# EAGLE design Power Outlet (EAGLE 6.4)
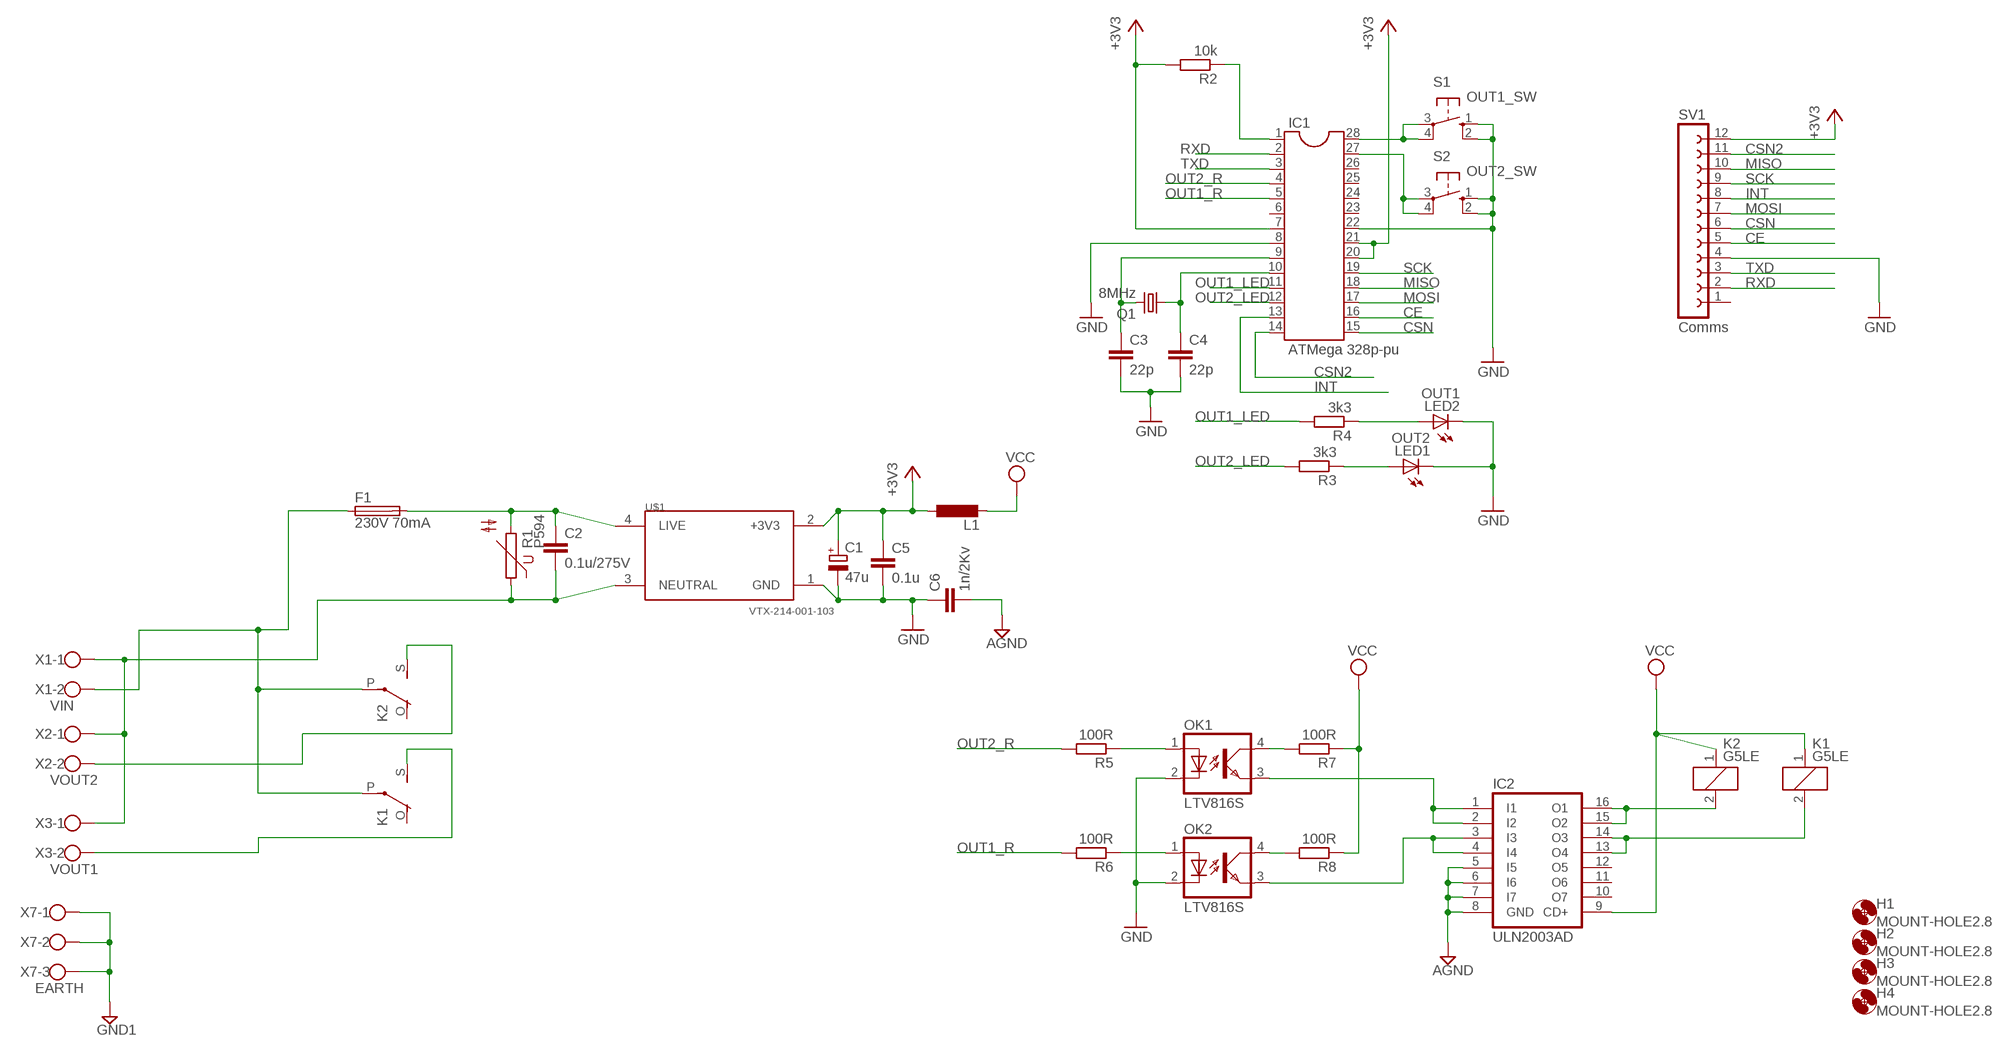
[diagram p0: schematic, sheet 1]

## Parts
C1  47u  CPOL-EUE2,5-6E  [E2,5-6E]
C2  0.1u/275V  C-EU050-030X075  [C050-030X075]
C3  22p  C-EUC1206K  [C1206K]
C4  22p  C-EUC1206K  [C1206K]
C5  0.1u  C-EUC1206K  [C1206K]
C6  1n/2Kv  C-EUC1206K  [C1206K]
F1  230V 70mA  FUSESH22,5A  [SH22,5A]
H1  MOUNT-HOLE2.8  [2,8]
H2  MOUNT-HOLE2.8  [2,8]
H3  MOUNT-HOLE2.8  [2,8]
H4  MOUNT-HOLE2.8  [2,8]
IC1  ATMega 328p-pu  DIL28-3  [DIL28-3]
IC2  ULN2003AD  [SO16]
K1  G5LE  [G5LE]
K2  G5LE  [G5LE]
L1  L-EUL3225P  [L3225P]
LED1  OUT2  LED5MM  [LED5MM]
LED2  OUT1  LED5MM  [LED5MM]
OK1  LTV816S  [SMD4]
OK2  LTV816S  [SMD4]
Q1  8MHz  CRYSTALHC49S  [HC49/S]
R1  P594  [P594]
R2  10k  R-EU_R1206W  [R1206W]
R3  3k3  R-EU_R1206W  [R1206W]
R4  3k3  R-EU_R1206W  [R1206W]
R5  100R  R-EU_R1206W  [R1206W]
R6  100R  R-EU_R1206W  [R1206W]
R7  100R  R-EU_R1206W  [R1206W]
R8  100R  R-EU_R1206W  [R1206W]
S1  OUT1_SW  40-XX  [B3F-40XX]
S2  OUT2_SW  40-XX  [B3F-40XX]
SV1  Comms  FE12W  [FE12W]
U$1  VTX-214-001-103  [VTX214001103]
X1  VIN  W237-102  [W237-102]
X2  VOUT2  W237-102  [W237-102]
X3  VOUT1  W237-102  [W237-102]
X7  EARTH  W237-103  [W237-103]

## Nets
+3V3: C1.+ C5.1 IC1.7 IC1.20 IC1.21 L1.1 R2.2 SV1.12 U$1.2(+3V3)
AGND: C6.2 IC2.5(I5) IC2.6(I6) IC2.7(I7) IC2.8(GND)
CE: IC1.16 SV1.5
CSN: IC1.15 SV1.6
CSN2: IC1.14 SV1.11
GND: C1.- C3.2 C4.2 C5.2 C6.1 IC1.8 IC1.22 LED1.K(C) LED2.K(C) OK1.2(C) OK2.2(C) S1.1(S) S1.2(S1) S2.1(S) S2.2(S1) SV1.4 U$1.1(GND)
GND1: X7.1 X7.2 X7.3
INT: IC1.13 SV1.8
MISO: IC1.18 SV1.10
MOSI: IC1.17 SV1.7
N$1: F1.1 K1.P(2:P) K2.P(2:P) X1.2
N$2: C2.1 F1.2 R1.2 U$1.4(LIVE)
N$3: C2.2 R1.1 U$1.3(NEUTRAL) X1.1 X2.1 X3.1
N$4: IC1.1 R2.1
N$5: C3.1 IC1.9 Q1.2
N$6: C4.1 IC1.10 Q1.1
N$7: LED1.A R3.1
N$8: LED2.A R4.1
N$9: IC1.28 S1.3(P) S1.4(P1)
N$10: IC1.27 S2.3(P) S2.4(P1)
N$11: K2.S(2:S) X2.2
N$12: IC2.15(O2) IC2.16(O1) K2.2
N$13: IC2.13(O4) IC2.14(O3) K1.2
N$14: K1.S(2:S) X3.2
N$15: OK1.1(A) R5.1
N$16: OK2.1(A) R6.1
N$17: IC2.1(I1) IC2.2(I2) OK1.3(EMIT)
N$18: IC2.3(I3) IC2.4(I4) OK2.3(EMIT)
N$19: OK1.4(COL) R7.2
N$20: OK2.4(COL) R8.2
OUT1_LED: IC1.11 R4.2
OUT1_R: IC1.5 R6.2
OUT2_LED: IC1.12 R3.2
OUT2_R: IC1.4 R5.2
RXD: IC1.2 SV1.2
SCK: IC1.19 SV1.9
TXD: IC1.3 SV1.3
VCC: IC2.9(CD+) K1.1 K2.1 L1.2 R7.1 R8.1
Unconnected: IC1.6 IC1.23 IC1.24 IC1.25 IC1.26 IC2.10(O7) IC2.11(O6) IC2.12(O5) K1.O(2:O) K2.O(2:O) SV1.1

## Library data of the parts
C1 = rcl:CPOL-EU: POLARIZED CAPACITOR, European symbol
C2-C6 = rcl:C-EU: CAPACITOR, European symbol
F1 = fuse:FUSE: Fuse; OC_FARNELL: unknown; OC_NEWARK: unknown
H1-H4 = holes:MOUNT-HOLE: MOUNTING HOLE with drill center marker
IC1 = ic-package:DIL28: Dual In Line
IC2 = uln-udn:ULN2003A: DRIVER ARRAY
K1 K2 = relay:G5LE: RELAY 1 x switch, 10 A/120 V AC, 8 A/30 V DC, Omron; OC_FARNELL: unknown; OC_NEWARK: unknown
L1 = rcl:L-EU: INDUCTOR, European symbol
LED1 LED2 = led:LED: LED OSRAM: - CHIPLED LG R971, LG N971, LY N971, LG Q971, LY Q971, LO R971, LY R971 LH N974, LH R974 LS Q976, LO Q976, LY Q976 LO Q996 - Hyper CHIPLED LW Q18S LB Q993, LB Q99A, LB R99A - SideLED LS A670, LO A670, LY A670, LG A670, LP A670 LB A673, LV A673, LT A673, LW A673 LH A674 LY A675 LS A676, LA A676, LO A676, LY A676, LW A676 LS A679, LY A679, LG A679 - Hyper Micro SIDELED® LS Y876, LA Y876, LO Y876, LY Y876 LT Y87S - SmartLED LW L88C, LW L88S LB L89C, LB L89S, LG L890 LS L89K, LO L89K, LY L89K LS L896, LA L896, LO L896, LY L896 - TOPLED LS T670, LO T670, LY T670, LG T670, LP T670 LSG T670, LSP T670, LSY T670, LOP T670, LYG T670 LG T671, LOG T671, LSG T671 LB T673, LV T673, LT T673, LW T673 LH T674 LS T676, LA T676, LO T676, LY T676, LB T676, LH T676, LSB T676, LW T676 LB T67C, LV T67C, LT T67C, LS T67K, LO T67K, LY T67K, LW E67C LS E67B, LA E67B, LO E67B, LY E67B, LB E67C, LV E67C, LT E67C LW T67C LS T679, LY T679, LG T679 LS T770, LO T770, LY T770, LG T770, LP T770 LB T773, LV T773, LT T773, LW T773 LH T774 LS E675, LA E675, LY E675, LS T675 LS T776, LA T776, LO T776, LY T776, LB T776 LHGB T686 LT T68C, LB T68C - Hyper Mini TOPLED® LB M676 - Mini TOPLED Santana® LG M470 LS M47K, LO M47K, LY M47K Source: http://www.osram.convergy.de LUXEON: - LUMILED® LXK2-PW12-R00, LXK2-PW12-S00, LXK2-PW14-U00, LXK2-PW14-V00 LXK2-PM12-R00, LXK2-PM12-S00, LXK2-PM14-U00 LXK2-PE12-Q00, LXK2-PE12-R00, LXK2-PE12-S00, LXK2-PE14-T00, LXK2-PE14-U00 LXK2-PB12-K00, LXK2-PB12-L00, LXK2-PB12-M00, LXK2-PB14-N00, LXK2-PB14-P00, LXK2-PB14-Q00 LXK2-PR12-L00, LXK2-PR12-M00, LXK2-PR14-Q00, LXK2-PR14-R00 LXK2-PD12-Q00, LXK2-PD12-R00, LXK2-PD12-S00 LXK2-PH12-R00, LXK2-PH12-S00 LXK2-PL12-P00, LXK2-PL12-Q00, LXK2-PL12-R00 Source: www.luxeon.com KINGBRIGHT: KA-3528ASYC Source: www.kingbright.com
OK1 OK2 = optocoupler:LTV816: OPTO COUPLER Source: LITEON, LTV816.pdf; OC_FARNELL: unknown; OC_NEWARK: unknown
Q1 = crystal:CRYSTAL: CRYSTAL; OC_FARNELL: 1667008; OC_NEWARK: unknown
R1 = varistor:P594: VARISTOR
R2-R8 = rcl:R-EU_: RESISTOR, European symbol
S1 S2 = switch-omron:40-XX: OMRON SWITCH; MF: OMRON COMPONENTS USA; MPN: B3F-4000; OC_FARNELL: 176434; OC_NEWARK: 36K3105
SV1 = con-lsta:FE12W: FEMALE HEADER; OC_FARNELL: unknown; OC_NEWARK: unknown
U$1 = VTX214001103:VTX-214-001-103
X1-X3 = con-wago-500:W237-102: WAGO SCREW CLAMP; MPN: 237-102; OC_FARNELL: unknown; OC_NEWARK: 70K9898
X7 = con-wago-500:W237-103: WAGO SCREW CLAMP; MPN: 237-103; OC_FARNELL: unknown; OC_NEWARK: 18M7116

## Board
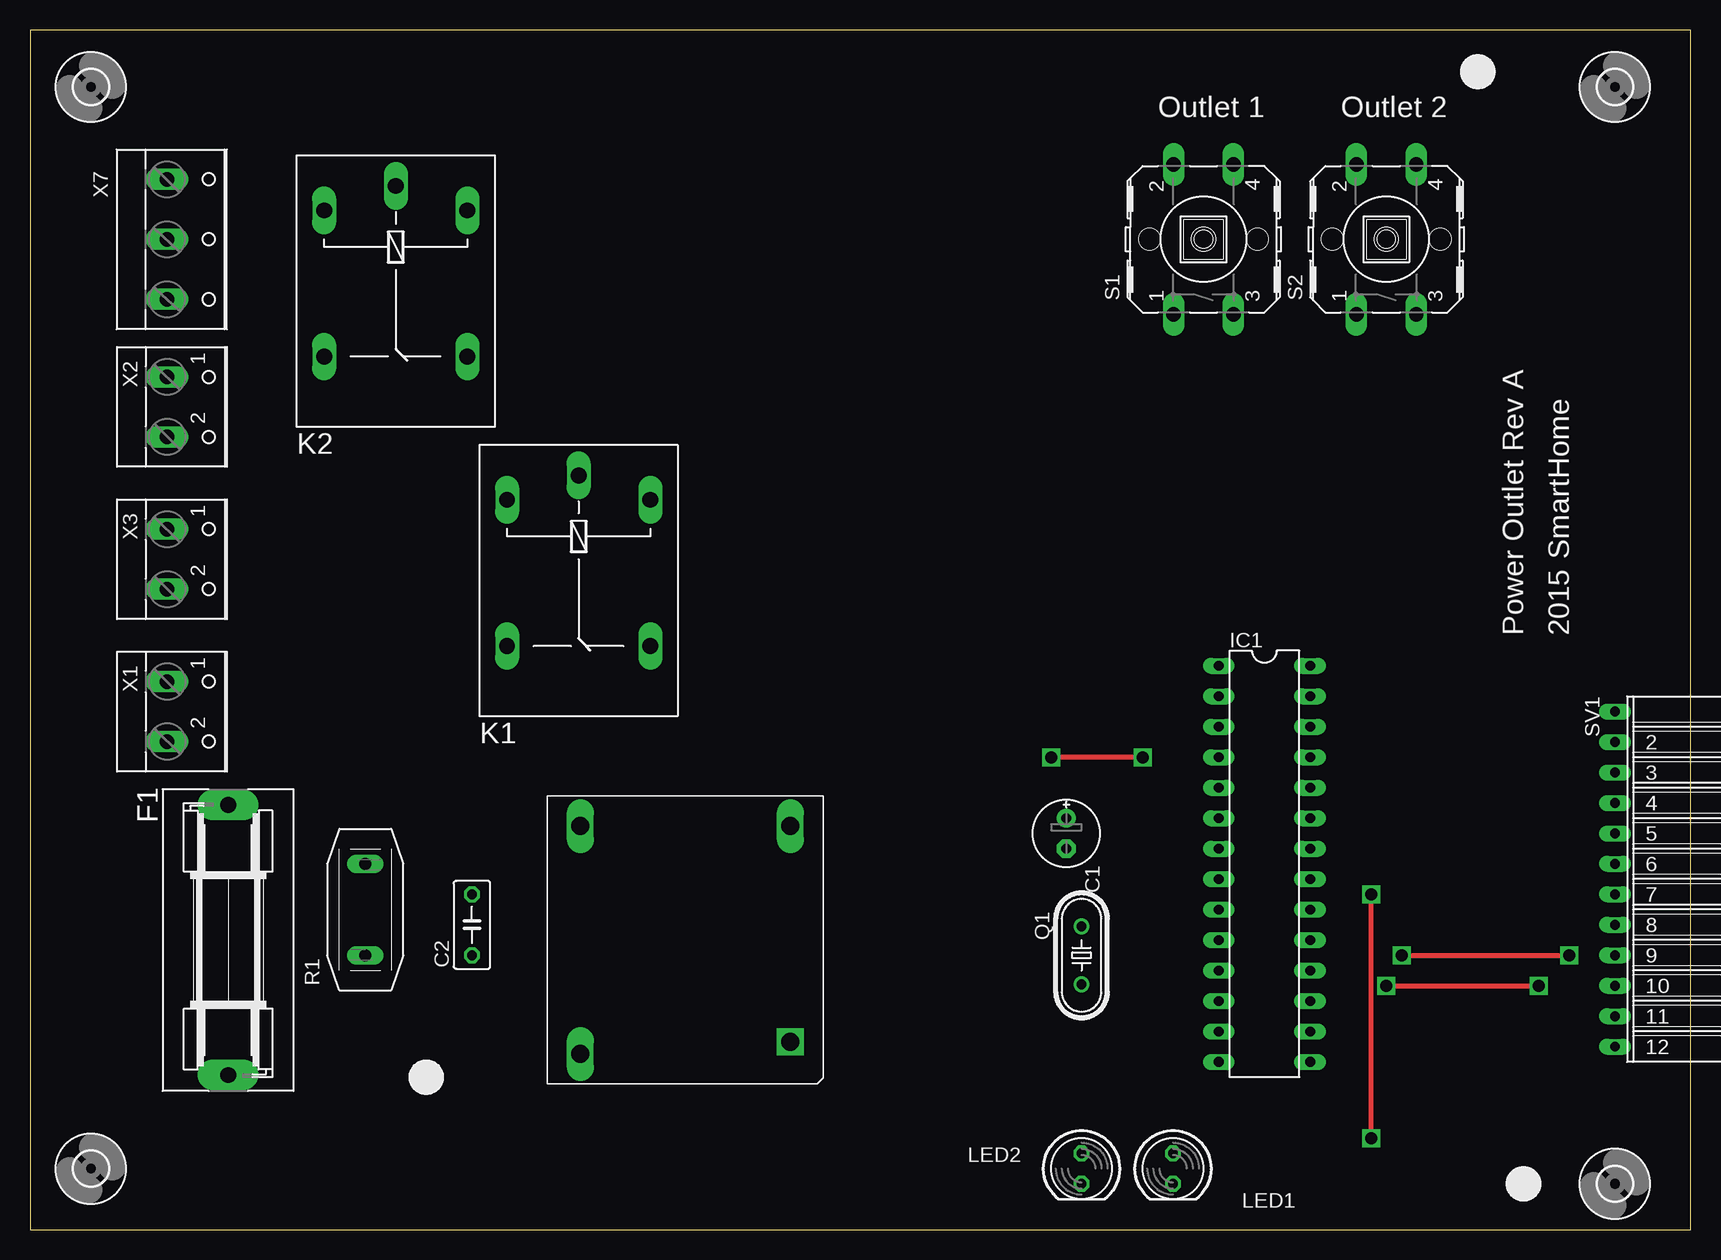
[diagram p1: board, top side]
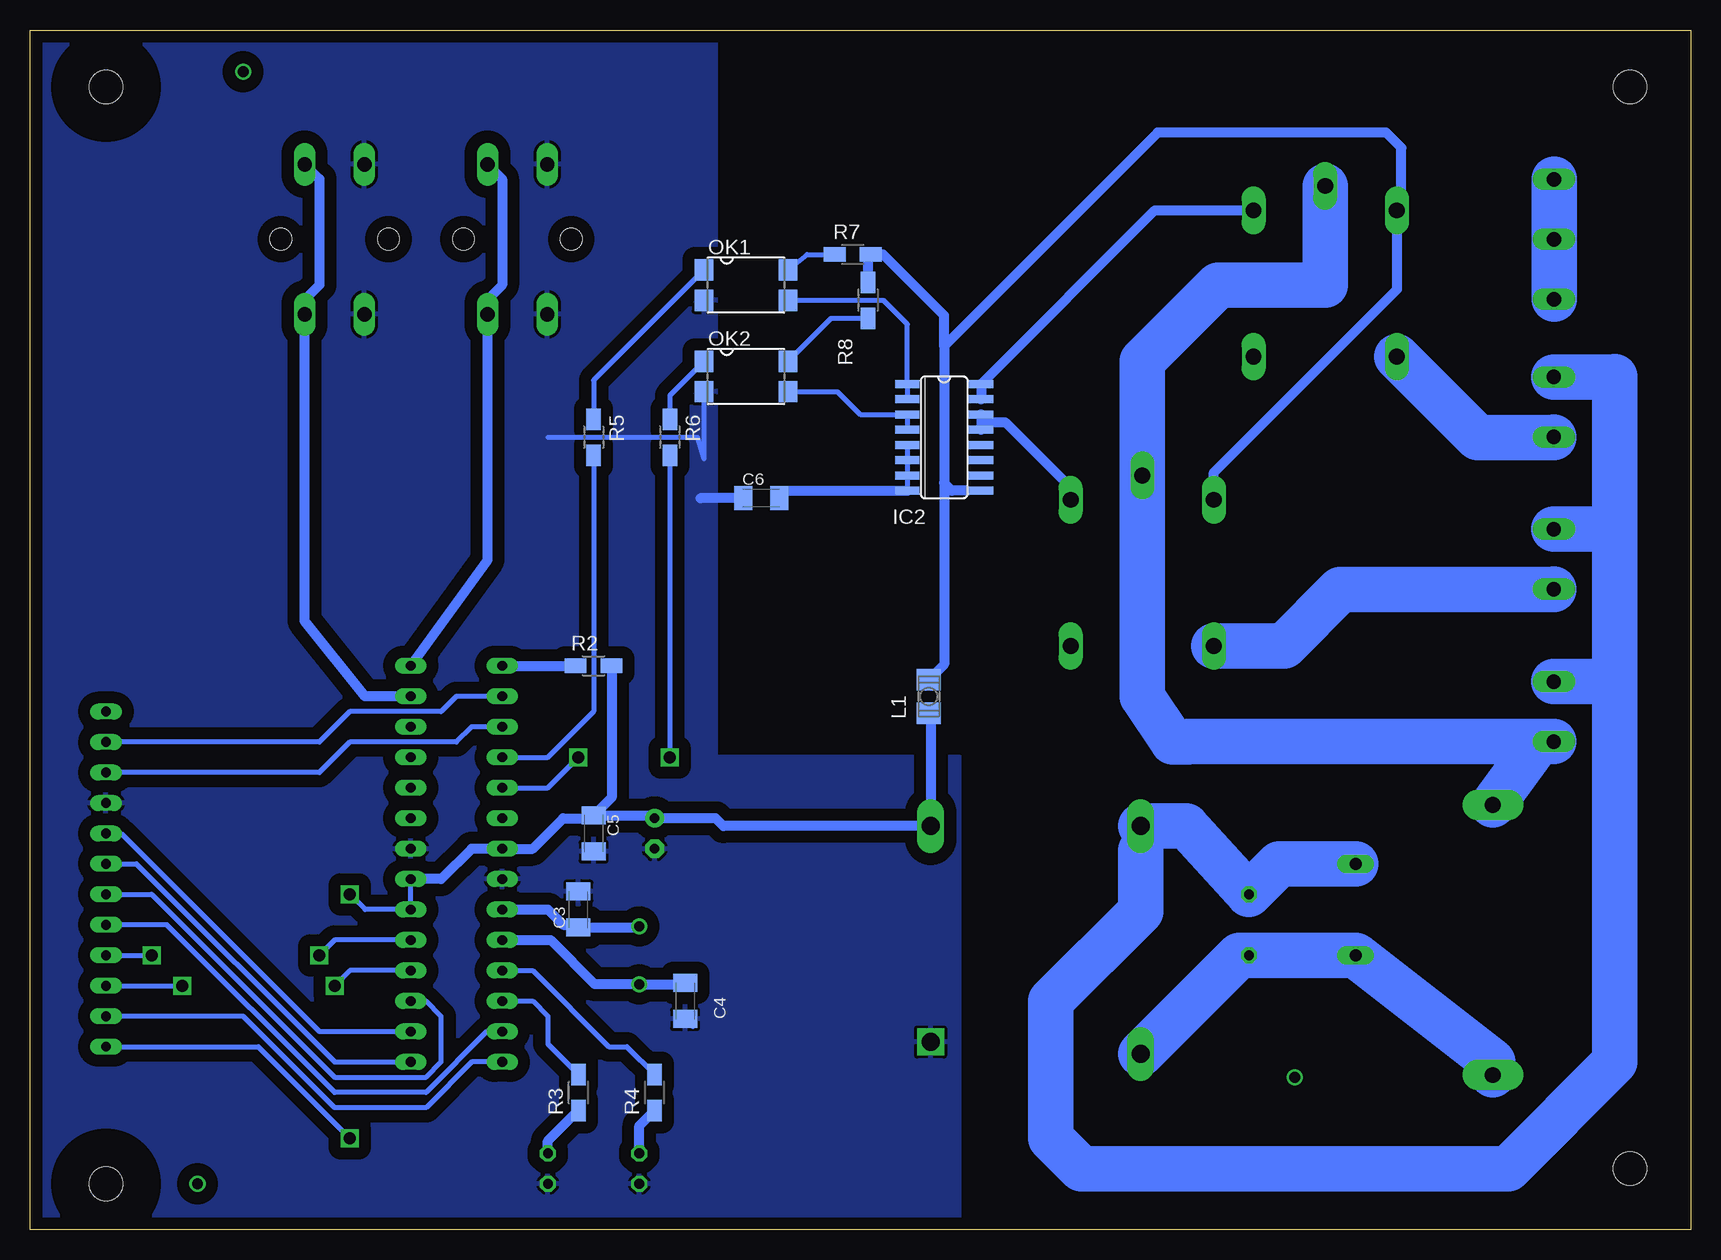
[diagram p2: board, bottom side, seen from below]

Size 138.41 x 100 mm. Coordinates in mm from the lower left corner, seen from the top.
Outline: 0,0 138.41,0 138.41,100 0,100 0,0
Copper layers (1*16): Top 0.035mm / dielectric 1.5mm / Bottom 0.035mm
Design rules "default": minimum track width 10mil, minimum drill 24mil, track to track 8mil, track to pad 8mil, pad to pad 8mil, via to via 8mil, smd to smd 8mil, copper to edge 40mil, drill to drill 8mil, minimum pad ring 10mil, minimum via ring 8mil, stop-mask expansion 4mil, vias tented up to drill 0mil, thermal gap 10mil

### Footprints (pad centres in the part's own frame; a part is rotated, then mirrored left to right if it is on the bottom)
E2,5-6E = drill 0.813 pad 1.575: + -1.27,0 | drill 0.813 pad 1.575 octagon: - 1.27,0
C050-030X075 = drill 0.813 octagon: 1 -2.54,0; 2 2.54,0
C1206K = smd 1.5 x 2: 1 -1.5,0; 2 1.5,0
SH22,5A = drill 1.321 pad 2.54 long: 1 -11.252,0; 2 11.252,0
2,8 = hole 2.8: 0,0
DIL28-3 = drill 0.813 long: 1 -16.51,-3.81; 2 -13.97,-3.81; 3 -11.43,-3.81; 4 -8.89,-3.81; 5 -6.35,-3.81; 6 -3.81,-3.81; 7 -1.27,-3.81; 8 1.27,-3.81; 9 3.81,-3.81; 10 6.35,-3.81; 11 8.89,-3.81; 12 11.43,-3.81; 13 13.97,-3.81; 14 16.51,-3.81; 15 16.51,3.81; 16 13.97,3.81; 17 11.43,3.81; 18 8.89,3.81; 19 6.35,3.81; 20 3.81,3.81; 21 1.27,3.81; 22 -1.27,3.81; 23 -3.81,3.81; 24 -6.35,3.81; 25 -8.89,3.81; 26 -11.43,3.81; 27 -13.97,3.81; 28 -16.51,3.81
SO16 = smd 0.66 x 2.032: 1 -4.445,-3.073; 2 -3.175,-3.073; 3 -1.905,-3.073; 4 -0.635,-3.073; 5 0.635,-3.073; 6 1.905,-3.073; 7 3.175,-3.073; 8 4.445,-3.073; 9 4.445,3.073; 10 3.175,3.073; 11 1.905,3.073; 12 0.635,3.073; 13 -0.635,3.073; 14 -1.905,3.073; 15 -3.175,3.073; 16 -4.445,3.073
G5LE = drill 1.321 long: 1 -7.493,-5.969; 2 -7.493,5.969; O 4.699,5.969; P -9.525,0; S 4.699,-5.969
L3225P = smd 1.8 x 2: 1 -1.4,0; 2 1.4,0
LED5MM = drill 0.813 octagon: A -1.27,0; K 1.27,0
SMD4 = smd 1.78 x 1.55: 1 -1.27,-3.5; 2 1.27,-3.5; 3 1.27,3.5; 4 -1.27,3.5
HC49/S = drill 0.813: 1 -2.413,0; 2 2.413,0
P594 = drill 1.016 long: 1 0,3.81; 2 0,-3.81
R1206W = smd 1.8 x 1.2: 1 -1.499,0; 2 1.499,0
B3F-40XX = drill 1.194 long: 1 -6.248,2.489; 2 6.248,2.489; 3 -6.248,-2.489; 4 6.248,-2.489 | hole 1.803: 0,-4.496; 0,4.496
FE12W = drill 0.813 long: 1 -13.97,0; 2 -11.43,0; 3 -8.89,0; 4 -6.35,0; 5 -3.81,0; 6 -1.27,0; 7 1.27,0; 8 3.81,0; 9 6.35,0; 10 8.89,0; 11 11.43,0; 12 13.97,0
VTX214001103 = drill 1.5 square: 1 8.75,-8.5 | drill 1.5 long: 2 8.75,9.5; 3 -8.75,9.5; 4 -8.75,-9.5
W237-102 = drill 1.194 long: 1 -2.5,-1.27; 2 2.5,-1.27
W237-103 = drill 1.194 long: 1 -5,-1.29; 2 0,-1.29; 3 5,-1.29

### Placement (x,y rotation side)
C1  86.36,33.02 270 top
C2  36.83,25.4 90 top
C3  92.71,26.67 90 bottom
C4  83.82,19.05 270 bottom
C5  91.44,33.02 270 bottom
C6  77.47,60.96 0 bottom
F1  16.51,24.13 270 top
H1  5.08,5.08 0 top
H2  132.08,3.81 0 top
H3  132.08,95.25 0 top
H4  5.08,95.25 0 top
IC1  102.87,30.48 270 top
IC2  62.23,66.04 270 bottom
K1  45.72,53.34 270 top
K2  30.48,77.47 270 top
L1  63.5,44.45 90 bottom
LED1  95.25,5.08 270 top
LED2  87.63,5.08 270 top
OK1  78.74,78.74 270 bottom
OK2  78.74,71.12 270 bottom
Q1  87.63,22.86 90 top
R1  27.94,26.67 0 top
R2  91.44,46.99 0 bottom
R3  92.71,11.43 90 bottom
R4  86.36,11.43 90 bottom
R5  91.44,66.04 270 bottom
R6  85.09,66.04 270 bottom
R7  69.85,81.28 180 bottom
R8  68.58,77.47 270 bottom
S1  97.79,82.55 90 top
S2  113.03,82.55 90 top
SV1  132.08,29.21 270 top
U$1  54.61,24.13 0 top
X1  12.7,43.18 270 top
X2  12.7,68.58 270 top
X3  12.7,55.88 270 top
X7  12.7,82.55 270 top

### Tracks (layer width: path | path; a pad name or v marks a point on that pad's centre or on a via)
+3V3  (via drill 1)
  Top 0.406: v111.76,7.62 v111.76,27.94
  Bottom 0.406: L1.1 63.36,42.91 | IC1.21 IC1.20 110.49,26.67 v111.76,27.94 | SV1.12 119.38,15.24 v111.76,7.62
  Bottom 0.813: C5.1 86.59,34.52 C1.+ 81.28,34.29 80.62,33.63 U$1.2 63.36,42.91 | C5.1 91.67,34.29 93.98,34.29 96.52,31.75 IC1.7 101.6,31.75 104.14,29.21 IC1.21 | R2.2 89.94,36.02 C5.1
AGND
  Bottom 0.406: IC2.5 IC2.6 IC2.7 IC2.8
  Bottom 0.813: C6.2 75.33,61.59 IC2.8
CE
  Bottom 0.406: SV1.5 130.81,33.02 114.3,16.51 IC1.16
CSN
  Bottom 0.406: SV1.6 129.54,30.48 113.03,13.97 IC1.15
CSN2
  Bottom 0.406: IC1.14 101.6,13.97 105.41,10.16 113.03,10.16 120.65,17.78 SV1.11
GND
  Bottom 0.406: OK2.2 82.24,64.23 82.78,66.04 95.25,66.04 | C4.2 83.17,16.93
  Bottom 0.813: C6.1 82.55,60.96
  pour Bottom (isolate 1.016): 163.83,100.33 163.83,0 60.96,0 60.96,39.37 81.28,39.37 81.28,100.33
GND1
  Bottom 3.81: X7.3 X7.2 X7.1
INT
  Bottom 0.406: IC1.13 100.33,16.51 105.41,11.43 113.03,11.43 127,25.4 SV1.8
MISO  (via drill 1)
  Top 0.406: v113.03,20.32 v125.73,20.32
  Bottom 0.406: IC1.18 111.76,21.59 v113.03,20.32 | SV1.10 v125.73,20.32
MOSI
  Bottom 0.406: SV1.7 128.27,27.94 113.03,12.7 105.41,12.7 104.14,13.97 104.14,17.78 105.41,19.05 IC1.17
N$1
  Bottom 1.016: 45.72,63.5 K1.P
  Bottom 3.81: F1.1 12.7,40.64 X1.2 41.87,40.68 41.91,40.64 43.18,40.64 45.72,44.45 45.72,63.5 45.72,72.39 39.37,78.74 30.48,78.74 K2.P
N$2
  Bottom 3.81: F1.2 16.51,13.97 R1.2 C2.1 37.63,22.86 U$1.4
N$3
  Bottom 0.406: 45.86,31.61 U$1.3
  Bottom 3.81: R1.1 34.29,30.48 C2.2 42.08,33.66 U$1.3 | 45.86,31.61 45.86,26.53 53.34,19.05 53.34,7.62 50.8,5.08 15.24,5.08 6.35,13.97 6.35,45.68 | 6.35,45.68 6.35,58.38 | 6.35,58.38 6.35,71.12 6.39,71.08 X2.1 | X1.1 6.35,45.68 | X3.1 6.35,58.38
N$4
  Bottom 0.813: IC1.1 R2.1
N$5
  Bottom 0.813: IC1.9 95.25,26.67 93.98,25.4 92.94,25.4 C3.1 87.73,25.17 Q1.2
N$6
  Bottom 0.813: IC1.10 95.02,24.13 91.34,20.45 Q1.1 83.92,20.45 C4.1
N$7
  Bottom 0.813: LED1.A 95.25,7.39 R3.1
N$8
  Bottom 0.813: LED2.A 87.63,8.66 R4.1
N$9
  Bottom 0.813: IC1.28 100.28,55.83 S1.3 100.28,77.52 99.06,78.74 99.06,87.58 S1.4
N$10
  Bottom 0.813: IC1.27 110.49,44.45 115.52,50.75 S2.3 115.52,77.52 114.3,78.74 114.3,87.58 S2.4
N$11
  Bottom 3.81: K2.S 17.78,66.04 11.43,66.04 X2.2
N$12
  Bottom 0.813: K2.2 44.68,84.96 IC2.16 IC2.15
N$13
  Bottom 0.813: K1.2 51.69,61.85 57.15,67.31 58.52,67.31 IC2.13 IC2.14
N$14
  Bottom 3.81: K1.S 33.91,48.64 29.21,53.34 11.43,53.34 X3.2
N$15
  Bottom 0.406: OK1.1 91.44,70.81 R5.1
N$16
  Bottom 0.406: OK2.1 85.09,69.54 R6.1
N$17
  Bottom 0.406: IC2.2 IC2.1 65.3,75.46 67.31,77.47 OK1.3
N$18
  Bottom 0.406: OK2.3 71.12,69.85 69.22,67.94 IC2.3 IC2.4
N$19
  Bottom 0.406: OK1.4 73.66,81.28 R7.2
N$20
  Bottom 0.406: OK2.4 71.66,75.97 R8.2
N$21  (via drill 0.9)
  other vias: 120.65,96.52
N$22  (via drill 0.9)
  other vias: 124.46,3.81
N$23  (via drill 0.9)
  other vias: 33.02,12.7
OUT1_LED
  Bottom 0.406: IC1.11 96.52,21.59 90.17,15.24 88.67,15.24 R4.2
OUT1_R  (via drill 1)
  Top 0.406: v92.71,39.37 v85.09,39.37
  Bottom 0.406: IC1.5 95.25,36.83 v92.71,39.37 | R6.2 v85.09,39.37
OUT2_LED
  Bottom 0.406: IC1.12 96.52,19.05 95.25,17.78 95.25,15.47 R3.2
OUT2_R
  Bottom 0.406: IC1.4 95.25,39.37 91.44,43.18 R5.2
RXD
  Bottom 0.406: IC1.2 102.87,44.45 104.14,43.18 111.76,43.18 114.3,40.64 SV1.2
SCK  (via drill 1)
  Top 0.406: v114.3,22.86 v128.27,22.86
  Bottom 0.406: IC1.19 113.03,24.13 v114.3,22.86 | SV1.9 v128.27,22.86
TXD
  Bottom 0.406: IC1.3 101.6,41.91 102.87,40.64 111.76,40.64 114.3,38.1 SV1.3
VCC
  Bottom 0.406: IC2.9 60.33,61.59
  Bottom 0.813: 62.23,73.66 44.45,91.44 25.4,91.44 24.13,90.17 24.13,85.34 K2.1 24.51,78.36 39.75,63.12 K1.1 | 62.23,73.66 62.23,62.23 | 62.23,62.23 62.23,47.12 L1.2 | 60.33,61.59 61.59,61.59 62.23,62.23 | 62.23,73.66 62.23,76.2 67.31,81.28 R7.1 68.58,81.05 R8.1

### Text on the board
tNames: Outlet 1 | Outlet 2 | SmartHome | Power Outlet Rev A | 2015